# EAGLE design FeatherWing (EAGLE 9.6.2)
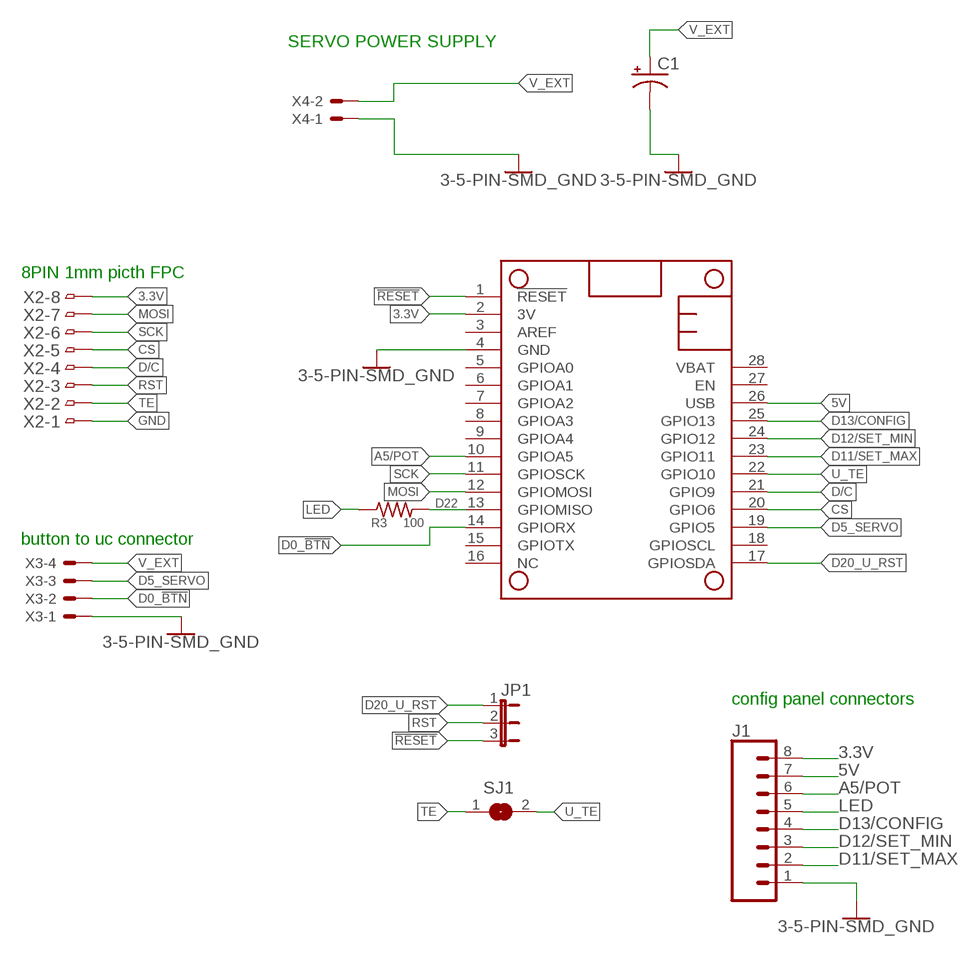
[diagram p0: schematic, sheet 1]

## Parts
C1  ADAFRUIT_CNCT_NFP_CPOL-USC/6032-28R  [ADAFRUIT_CNCT_NFP_C/6032-28R]
J1  SPARKFUN-CONNECTORS_CONN_08LONGPADS  [SPARKFUN-CONNECTORS_1X08_LONGPADS]
JP1  LED-BADGE_SCHEMATIC_JUMPER_JP2E  [LED-BADGE_SCHEMATIC_JUMPER_JP2]
MS1  ADAFRUIT_FEATHERWING  [ADAFRUIT_FEATHERWING]
R3  100  AIRPOCKETCELL_ARDUINO_3V_TTL_INTERFACE_2_PI_ADAFRUIT_R-US_M0805  [AIRPOCKETCELL_ARDUINO_3V_TTL_INTERFACE_2_PI_ADAFRUIT_M0805]
SJ1  AIRPOCKETCELL_JUMPER_SJW  [AIRPOCKETCELL_JUMPER_SJW]
X2  LEDMATRIXFPCCONNECTOR_CON-HIROSE_FH12-08S-1SH  [LEDMATRIXFPCCONNECTOR_CON-HIROSE_FH12-08S-1SH]
X3  REMBRANDT-ELECTRONICS---JST-XH-CONNECTORS-V1-0_JST-XH-04-PIN-LONG-PAD  [REMBRANDT-ELECTRONICS---JST-XH-CONNECTORS-V1-0_JST-XH-04-PACKAGE-LONG-PAD]
X4  REMBRANDT-ELECTRONICS---JST-XH-CONNECTORS-V1-0_JST-XH-02-PIN-LONG-PAD  [REMBRANDT-ELECTRONICS---JST-XH-CONNECTORS-V1-0_JST-XH-02-PACKAGE-LONG-PAD]

## Nets
3.3V: J1.8 MS1.2(3V) X2.8
5V: J1.7 MS1.26(USB)
!RESET: JP1.3 MS1.1(!RESET)
A5/POT: J1.6 MS1.10(GPIOA5)
CS: MS1.20(GPIO6) X2.5
D0_!BTN: MS1.14(GPIORX) X3.2
D5_SERVO: MS1.19(GPIO5) X3.3
D11/SET_MAX: J1.2 MS1.23(GPIO11)
D12/SET_MIN: J1.3 MS1.24(GPIO12)
D13/CONFIG: J1.4 MS1.25(GPIO13)
D20_U_RST: JP1.1 MS1.17(GPIOSDA)
D22: MS1.13(GPIOMISO) R3.2
D/C: MS1.21(GPIO9) X2.4
GND: C1.- J1.1 MS1.4(GND) X2.1 X3.1 X4.1 ; supply symbol labelled 3-5-PIN-SMD_GND
LED: J1.5 R3.1
MOSI: MS1.12(GPIOMOSI) X2.7
RST: JP1.2 X2.3
SCK: MS1.11(GPIOSCK) X2.6
TE: SJ1.1 X2.2
U_TE: MS1.22(GPIO10) SJ1.2
V_EXT: C1.+ X3.4 X4.2
Unconnected: MS1.3(AREF) MS1.5(GPIOA0) MS1.6(GPIOA1) MS1.7(GPIOA2) MS1.8(GPIOA3) MS1.9(GPIOA4) MS1.15(GPIOTX) MS1.16(NC) MS1.18(GPIOSCL) MS1.27(EN) MS1.28(VBAT)

## Notes on the sheet
- SERVO POWER SUPPLY
- 8PIN 1mm picth FPC
- button to uc connector
- config panel connectors

## Library data of the parts
C1 = FeatherWing:ADAFRUIT_CNCT_NFP_CPOL-US: POLARIZED CAPACITOR, American symbol
J1 = FeatherWing:SPARKFUN-CONNECTORS_CONN_08: Multi connection point. Often used as Generic Header-pin footprint for 0.1 inch spaced/style header connections On any of the 0.1 inch spaced packages, you can populate with these: Break Away Headers - Straight <https://www.sparkfun.com/products/116> (PRT-00116) Break Away Male Headers - Right Angle <https://www.sparkfun.com/products/553> (PRT-00553) Female Headers <https://www.sparkfun.com/products/115> (PRT-00115) Break Away Headers - Machine Pin <https://www.sparkfun.com/products/117> (PRT-00117) Break Away Female Headers - Swiss Machine Pin <https://www.sparkfun.com/products/743> (PRT-00743) Arduino Stackable Header - 8 Pin <https://www.sparkfun.com/products/9279> (PRT-09279) For SCREWTERMINALS and SPRING TERMINALS visit here: Screw Terimnals on SparkFun.com <https://www.sparkfun.com/search/results?term=Screw+Terminals> (5mm/3.5mm/2.54mm spacing) This device is also useful as a general connection point to wire up your design to another part of your project. Our various solder wires solder well into these plated through hole pads. Hook-Up Wire - Assortment (Stranded, 22 AWG) <https://www.sparkfun.com/products/11375> (PRT-11375) Hook-Up Wire - Assortment (Solid Core, 22 AWG) <https://www.sparkfun.com/products/11367> (PRT-11367) View the entire wire category on our website here <https://www.sparkfun.com/categories/141> Special notes: Molex polarized connector foot print use with SKU : PRT-08231 with associated crimp pins and housings. 1MM SMD Version SKU: PRT-10208 NOTES ON THE VARIANTS LOCK and LOCK_LONGPADS... This footprint was designed to help hold the alignment of a through-hole component (i.e. 6-pin header) while soldering it into place. You may notice that each hole has been shifted either up or down by 0.005 of an inch from it's more standard position (which is a perfectly straight line). This slight alteration caused the pins (the squares in the middle) to touch the edges of the holes. Because they are alternating, it causes a "brace" to hold the component in place. 0.005 has proven to be the perfect amount of "off-center" position when using our standard breakaway headers. Although looks a little odd when you look at the bare footprint, once you have a header in there, the alteration is very hard to notice. Also,if you push a header all the way into place, it is covered up entirely on the bottom side.
JP1 = FeatherWing:LED-BADGE_SCHEMATIC_JUMPER_JP2E: JUMPER
MS1 = FeatherWing:ADAFRUIT_FEATHERWING
R3 = FeatherWing:AIRPOCKETCELL_ARDUINO_3V_TTL_INTERFACE_2_PI_ADAFRUIT_R-US_: RESISTOR, American symbol
SJ1 = FeatherWing:AIRPOCKETCELL_JUMPER_SJ: SMD solder JUMPER
X2 = FeatherWing:LEDMATRIXFPCCONNECTOR_CON-HIROSE_FH12-08S-1S: 1mm Pitch Connectors For FPC/FFC Source: Data sheet <http://www.hirose.co.jp/cataloge_hp/e58605370.pdf>; OC_FARNELL: unknown; OC_NEWARK: unknown
X3 = FeatherWing:REMBRANDT-ELECTRONICS---JST-XH-CONNECTORS-V1-0_JST-XH-04-PIN: JST XH Connector 2 Pin Wire to board connector. Pitch: 2,54 mm, (0.100") Number of pins: 4 Created by Rembrandt Electronics www.rembrandtelectronics.com
X4 = FeatherWing:REMBRANDT-ELECTRONICS---JST-XH-CONNECTORS-V1-0_JST-XH-02-PIN: JST XH Connector 2 Pin Wire to board connector. Pitch: 2,54 mm, (0.100") Number of pins: 2 Created by Rembrandt Electronics www.rembrandtelectronics.com

## Board
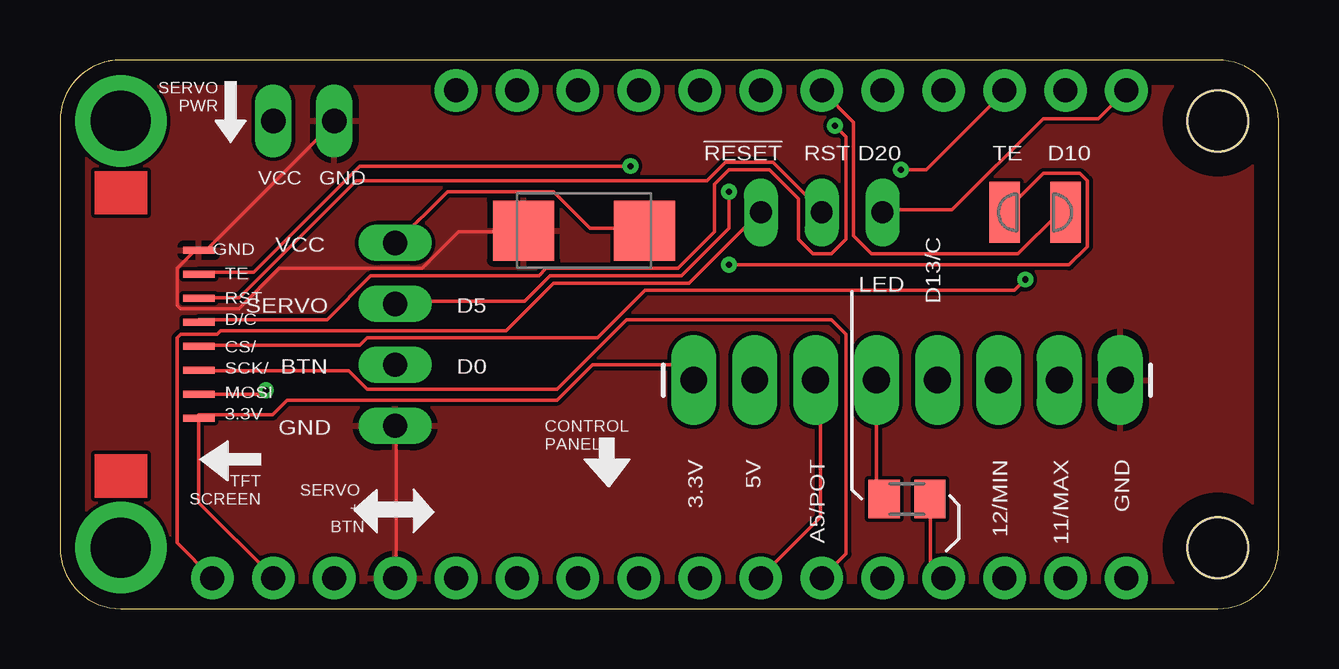
[diagram p1: board, top side]
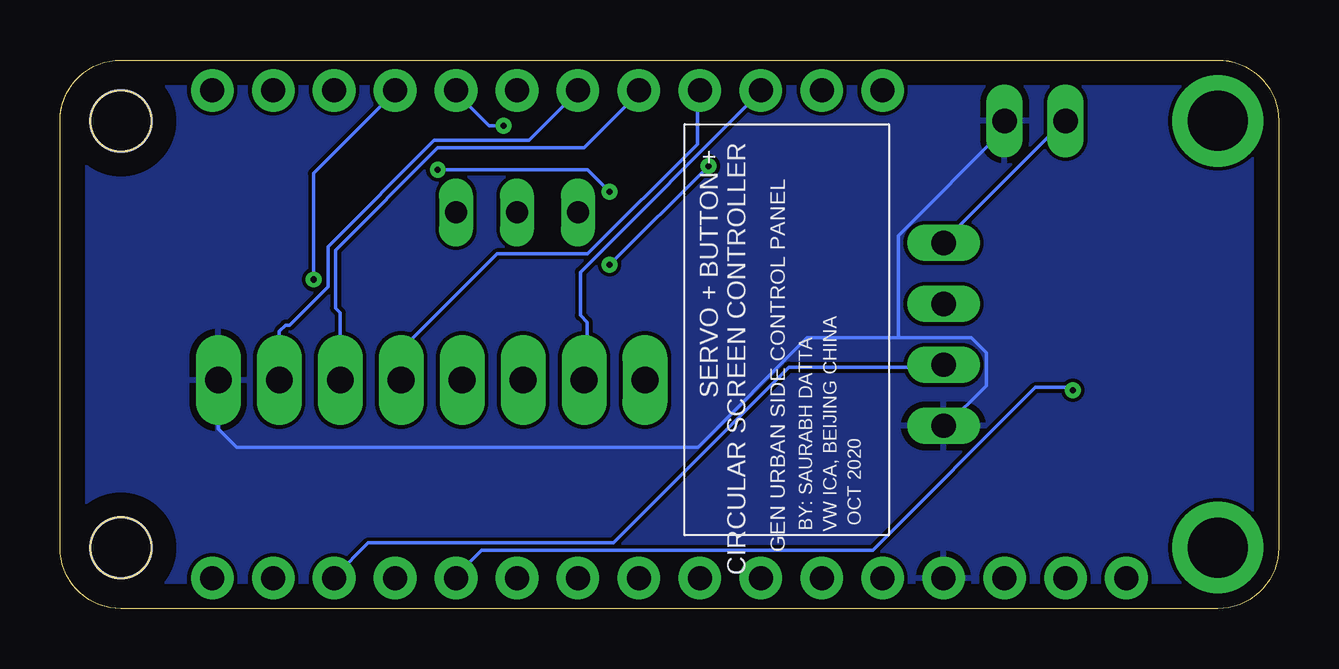
[diagram p2: board, bottom side, seen from below]

Size 50.8 x 22.86 mm. Coordinates in mm from the lower left corner, seen from the top.
Outline: 0,20.32 0,2.54 arc90 2.54,0 48.26,0 48.48,0.01 arc85 50.8,2.54 50.8,20.32 50.79,20.54 arc85 48.26,22.86 2.54,22.86 2.32,22.85 arc85 0,20.32
Outline: circle at 48.26,2.54 radius 1.27
Outline: circle at 48.26,20.32 radius 1.27
Copper layers (1*16): Top 0.035mm / dielectric 1.5mm / Bottom 0.035mm
Design rules "default *": minimum track width 6mil, minimum drill 0.35mm, track to track 6mil, track to pad 6mil, pad to pad 6mil, via to via 6mil, smd to smd 6mil, copper to edge 40mil, drill to drill 6mil, minimum pad ring 10mil, minimum via ring 8mil, stop-mask expansion 4mil, vias tented up to drill 10mil, thermal gap 10mil
Holes 2.54 mm at 48.26,20.32 48.26,2.54

### Footprints (pad centres in the part's own frame; a part is rotated, then mirrored left to right if it is on the bottom)
ADAFRUIT_CNCT_NFP_C/6032-28R = smd 2.55 x 2.5: + 2.525,0; - -2.525,0
SPARKFUN-CONNECTORS_1X08_LONGPADS = drill 1.118 pad 1.88 long: 1 0,0; 2 2.54,0; 3 5.08,0; 4 7.62,0; 5 10.16,0; 6 12.7,0; 7 15.24,0; 8 17.78,0
LED-BADGE_SCHEMATIC_JUMPER_JP2 = drill 0.914 long: 1 -2.54,0; 2 0,0; 3 2.54,0
ADAFRUIT_FEATHERWING = drill 1 pad 1.778: 1 6.35,1.27; 2 8.89,1.27; 3 11.43,1.27; 4 13.97,1.27; 5 16.51,1.27; 6 19.05,1.27; 7 21.59,1.27; 8 24.13,1.27; 9 26.67,1.27; 10 29.21,1.27; 11 31.75,1.27; 12 34.29,1.27; 13 36.83,1.27; 14 39.37,1.27; 15 41.91,1.27; 16 44.45,1.27; 17 44.45,21.59; 18 41.91,21.59; 19 39.37,21.59; 20 36.83,21.59; 21 34.29,21.59; 22 31.75,21.59; 23 29.21,21.59; 24 26.67,21.59; 25 24.13,21.59; 26 21.59,21.59; 27 19.05,21.59; 28 16.51,21.59 | drill 2.5 pad 3.81: P$1 2.54,20.32; P$2 2.54,2.54 | hole 2.54: 48.26,20.32; 48.26,2.54
AIRPOCKETCELL_ARDUINO_3V_TTL_INTERFACE_2_PI_ADAFRUIT_M0805 = smd 1.3 x 1.6: 1 -0.95,0; 2 0.95,0
AIRPOCKETCELL_JUMPER_SJW = smd 1.27 x 2.54: 1 -1.27,0; 2 1.27,0
LEDMATRIXFPCCONNECTOR_CON-HIROSE_FH12-08S-1SH = smd 0.3 x 1.3: 1 -3.5,3.25; 2 -2.5,3.25; 3 -1.5,3.25; 4 -0.5,3.25; 5 0.5,3.25; 6 1.5,3.25; 7 2.5,3.25; 8 3.5,3.25
REMBRANDT-ELECTRONICS---JST-XH-CONNECTORS-V1-0_JST-XH-04-PACKAGE-LONG-PAD = drill 1.016 long: 1 -3.81,0; 2 -1.27,0; 3 1.27,0; 4 3.81,0
REMBRANDT-ELECTRONICS---JST-XH-CONNECTORS-V1-0_JST-XH-02-PACKAGE-LONG-PAD = drill 1.016 long: 1 -1.27,0; 2 1.27,0

### Placement (x,y rotation side)
C1  21.84,15.75 0 top
J1  44.2,9.52 180 top
JP1  31.75,16.51 180 top
MS1  0,0 0 top
R3  35.31,4.57 0 top
SJ1  40.64,16.51 0 top
X2  2.54,11.43 270 top
X3  13.97,11.43 90 top
X4  10.16,20.32 180 top

### Tracks (layer width: path | path; a pad name or v marks a point on that pad's centre or on a via)
3.3V
  Top 0.152: MS1.2 8.84,1.37 5.79,4.42 X2.8 5.79,8.08 8.87,8.08 9.47,8.69 20.73,8.69 22.2,10.16 25.78,10.16 J1.8
5V
  Bottom 0.152: MS1.26 21.64,21.49 29.11,14.02 29.11,12.22 28.83,11.94 28.83,9.65 J1.7
!RESET
  Top 0.152: MS1.1 4.88,2.74 4.88,11.28 5.03,11.43 6.55,11.43 6.71,11.58 18.59,11.58 20.57,13.56 26.21,13.56 29.11,16.46 JP1.3
A5/POT
  Top 0.152: MS1.10 29.26,1.37 31.7,3.81 31.7,9.32 J1.6
CS  (via drill 0.25)
  Top 0.152: v40.23,13.72 39.78,13.26 24.38,13.26 22.4,11.28 12.8,11.28 12.5,10.97 5.79,10.97 X2.5
  Bottom 0.152: v40.23,13.72 40.23,18.14 36.88,21.49 MS1.20
D0_!BTN
  Bottom 0.152: X3.2 14.02,10.06 20.42,10.06 27.74,2.74 37.95,2.74 39.32,1.37 MS1.14
D5_SERVO  (via drill 0.25)
  Top 0.152: v27.89,17.37 27.89,15.85 25.91,13.87 20.42,13.87 19.36,12.8 14.02,12.8 X3.3 | v35.05,18.29 36.12,18.29 39.32,21.49 MS1.19
  Bottom 0.152: v27.89,17.37 28.8,18.29 v35.05,18.29
D11/SET_MAX
  Bottom 0.152: MS1.23 29.26,21.49 31.24,19.51 35.2,19.51 39.62,15.09 39.62,13.41 41.22,11.81 41.4,11.81 41.66,11.56 J1.2
D12/SET_MIN
  Bottom 0.152: MS1.24 26.67,21.49 28.96,19.2 35.05,19.2 39.32,14.93 39.32,12.52 39.12,12.32 J1.3
D13/CONFIG
  Bottom 0.152: MS1.25 24.23,21.49 24.23,19.36 28.8,14.78 32.59,14.78 36.58,10.79 J1.4
D20_U_RST
  Top 0.152: MS1.17 43.28,20.42 41,20.42 37.19,16.61 34.29,16.61 JP1.1
D22
  Top 0.152: MS1.13 36.27,1.83 36.27,4.57 R3.2
D/C  (via drill 0.25)
  Top 0.152: v32.31,20.12 32.77,19.66 32.77,15.39 32.16,14.78 31.39,14.78 30.79,15.39 30.79,17.07 29.57,18.29 27.89,18.29 27.28,17.68 27.28,15.7 25.76,14.17 20.27,14.17 19.96,13.87 12.95,13.87 11.12,12.04 5.79,12.04 X2.4
  Bottom 0.152: v32.31,20.12 32.92,20.12 34.29,21.49 MS1.21
GND
  Top 0.152: X4.1 11.43,20.27 6.1,14.93 X2.1 5.64,14.93 4.88,14.17 4.88,12.65 5.03,12.5 7.47,12.5 9.14,14.17 15.09,14.17 16.61,15.7 19.2,15.7 C1.- | X3.1 14.02,7.62 14.02,1.37 MS1.4
  Bottom 0.152: 15.85,11.28 12.8,11.28 12.19,10.67 12.19,9.3 13.87,7.62 X3.1 | 15.85,11.28 19.66,11.28 24.21,6.73 43.43,6.73 44.2,7.49 J1.1 | X4.1 11.43,19.96 15.85,15.54 15.85,11.28
  pour Top: -7.62,32.77 -7.62,7.75 1.27,-1.14 50.8,-1.14 52.2,0.25 52.2,32.77
  pour Bottom: -5.21,29.72 -5.21,-1.91 53.21,-1.91 53.21,29.72
LED
  Top 0.152: 34.29,4.57 R3.1 34.04,4.89 J1.5
MOSI  (via drill 0.25)
  Top 0.152: X2.7 8.29,8.93 8.46,9.09 v8.59,9.09
  Bottom 0.152: v8.59,9.09 8.71,9.22 10.13,9.22 16.92,2.44 33.22,2.44 34.29,1.37 MS1.12
RST
  Top 0.152: X2.3 5.79,12.95 7.47,12.95 12.34,17.83 26.98,17.83 27.74,18.59 29.72,18.59 31.7,16.61 JP1.2
SCK
  Top 0.152: MS1.11 32.77,2.29 32.77,11.43 32.16,12.04 23.62,12.04 20.73,9.14 12.8,9.14 12.04,9.91 5.79,9.91 X2.6
TE  (via drill 0.25)
  Top 0.152: v23.77,18.44 12.5,18.44 8.08,14.02 5.79,14.02 X2.2 | v27.89,14.33 42.06,14.33 42.82,15.09 42.82,17.83 42.52,18.14 41,18.14 SJ1.1
  Bottom 0.152: v27.89,14.33 v23.77,18.44
U_TE
  Top 0.152: MS1.22 33.07,20.27 33.07,15.54 33.83,14.78 39.93,14.78 41.6,16.46 41.91,16.46 SJ1.2
V_EXT
  Top 0.152: C1.+ 24.23,15.85 22.1,15.85 20.57,17.37 16.15,17.37 14.02,15.24 X3.4
  Bottom 0.152: X4.2 8.99,20.27 14.02,15.24 X3.4

### Text on the board
tPlace: SERVO / PWR | !RESET | RST | D20 | TE | D10 | VCC | GND | VCC | D13/C | GND | TE | RST | SERVO | D5 | LED | D/C | CS/ | BTN | D0 | SCK/ | MOSI | 3.3V | GND | CONTROL / PANEL | TFT / SCREEN | 3.3V | 5V | A5/POT | 12/MIN | 11/MAX | GND | SERVO / + / BTN
bPlace: SERVO + BUTTON + / CIRCULAR SCREEN CONTROLLER | GEN URBAN SIDE CONTROL PANEL | VW ICA, BEIJING CHINA | BY: SAURABH DATTA | OCT 2020
tStop: VOLKSWAGEN | GROUP INNOVATION | CENTER ASIA